# Altium schematic sheet VELOLED.SchDoc
size A2
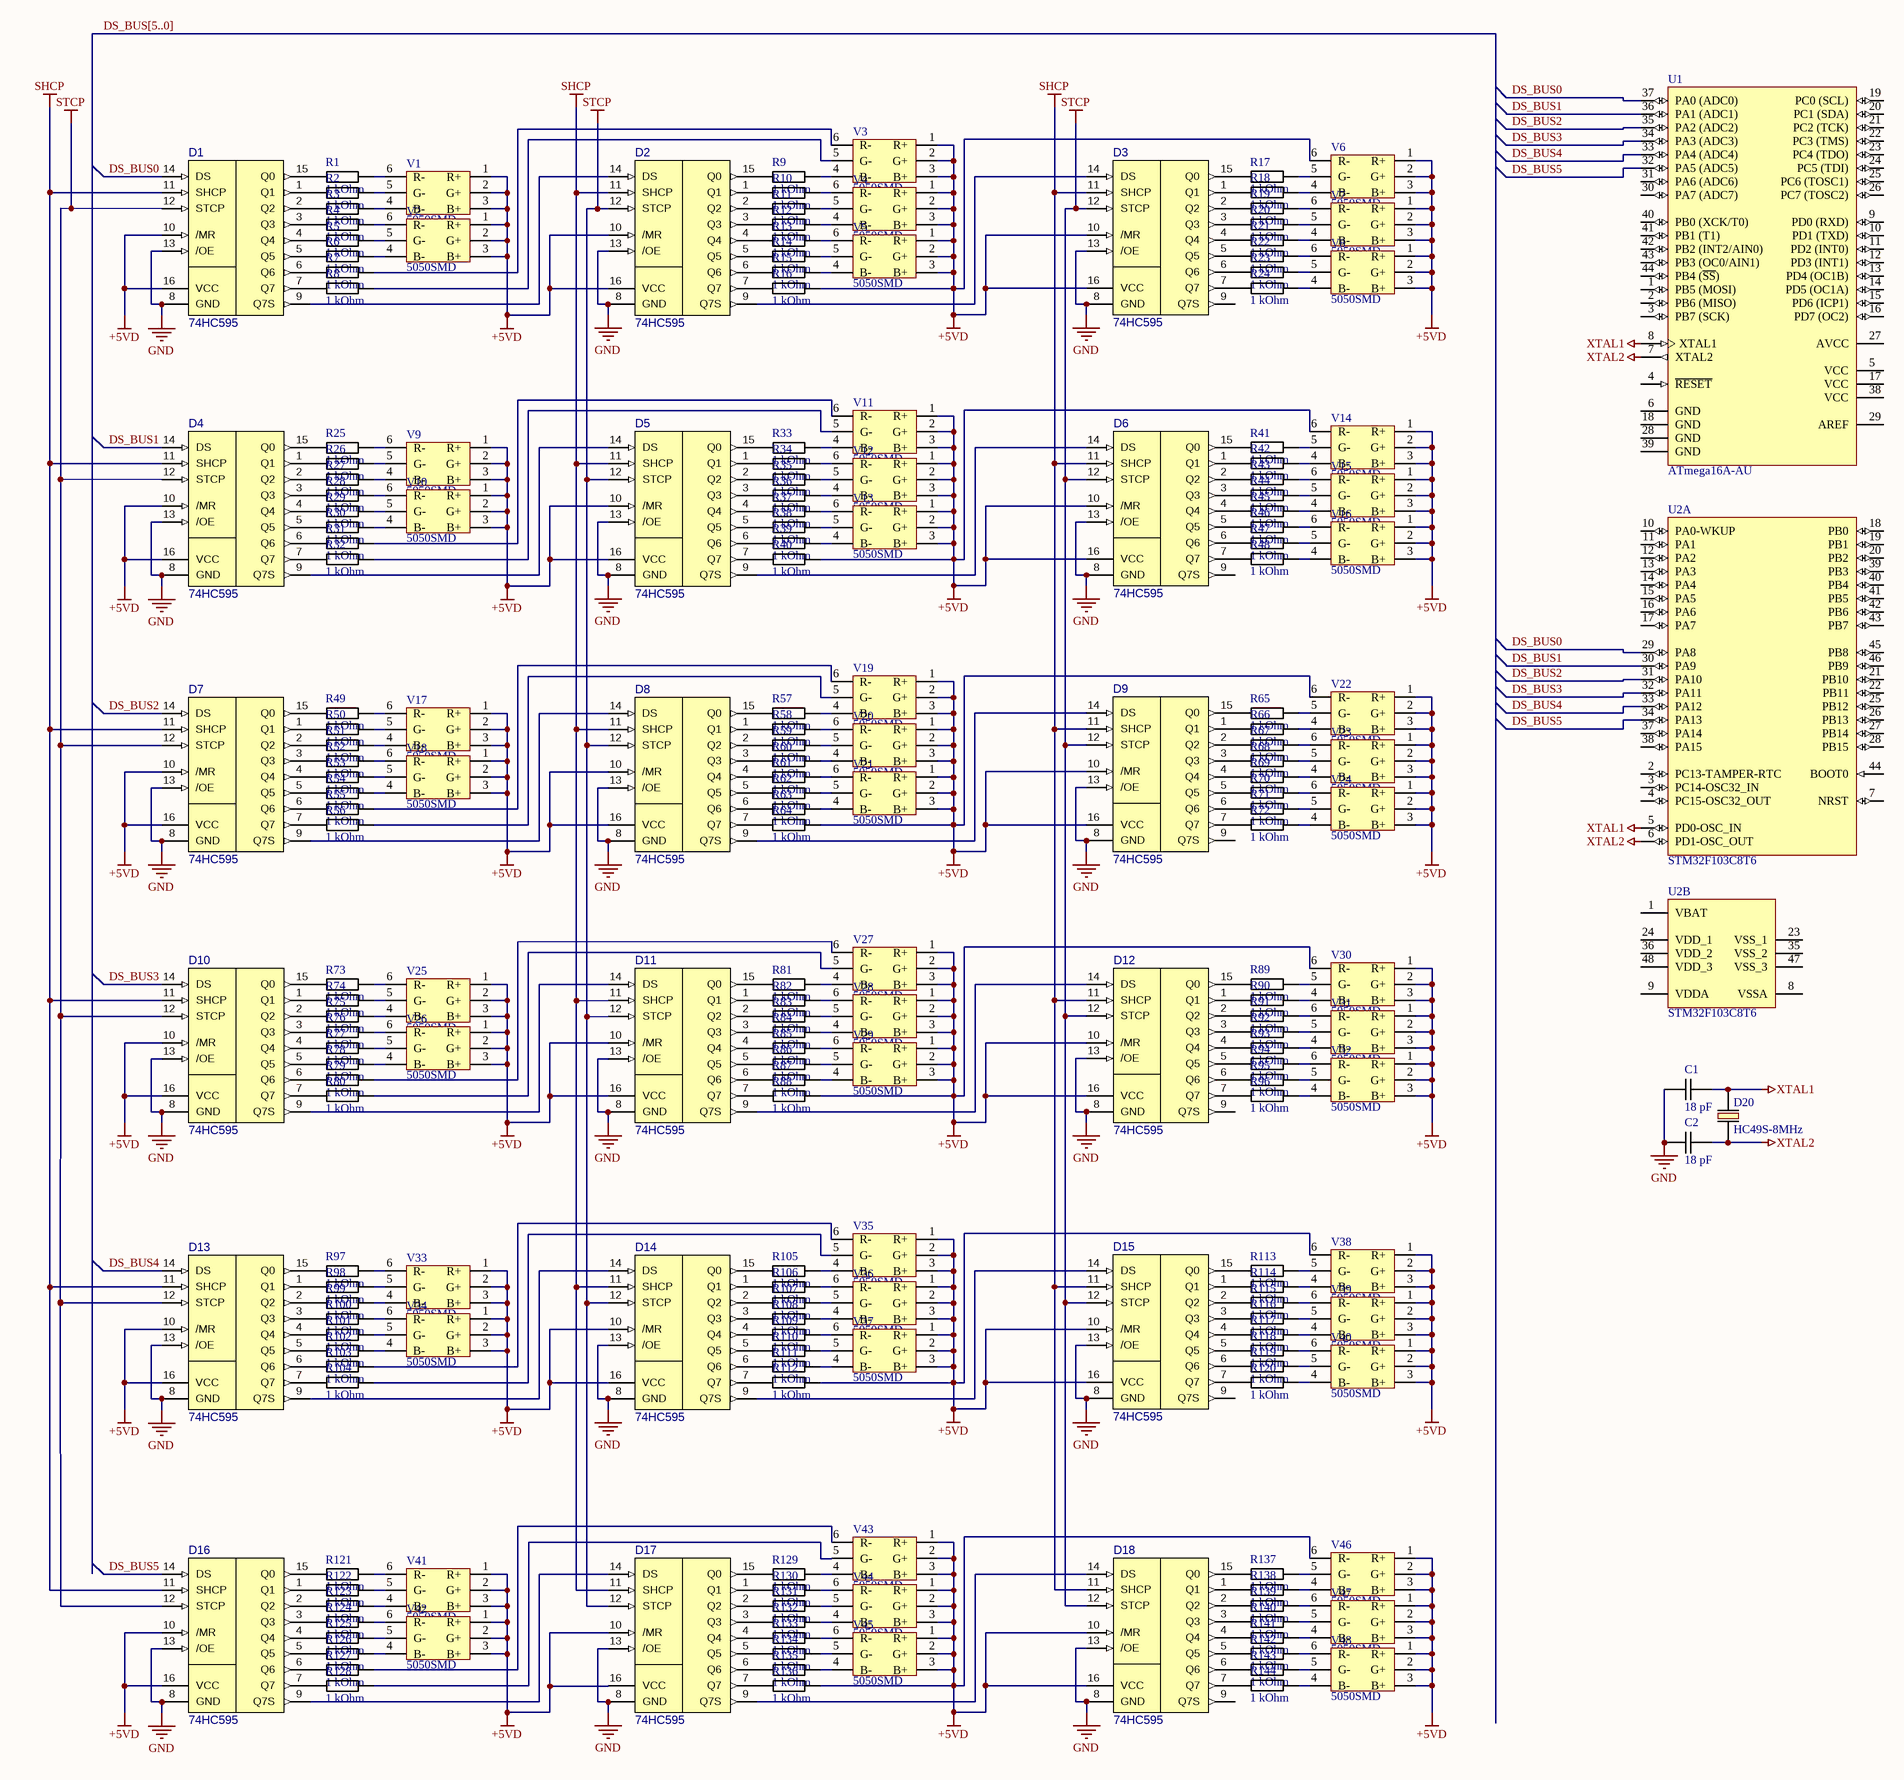
[diagram p0: VELOLED.SchDoc]

## Parts
C1  18 pF  [SMD0805]
C2  18 pF  [SMD0805]
D1  74HC595  [SO16]
D2  74HC595  [SO16]
D3  74HC595  [SO16]
D4  74HC595  [SO16]
D5  74HC595  [SO16]
D6  74HC595  [SO16]
D7  74HC595  [SO16]
D8  74HC595  [SO16]
D9  74HC595  [SO16]
D10  74HC595  [SO16]
D11  74HC595  [SO16]
D12  74HC595  [SO16]
D13  74HC595  [SO16]
D14  74HC595  [SO16]
D15  74HC595  [SO16]
D16  74HC595  [SO16]
D17  74HC595  [SO16]
D18  74HC595  [SO16]
D20  HC49S-8MHz  [HC49U]
R1  1 kOhm  [SMD0603]
R2  1 kOhm  [SMD0603]
R3  1 kOhm  [SMD0603]
R4  1 kOhm  [SMD0603]
R5  1 kOhm  [SMD0603]
R6  1 kOhm  [SMD0603]
R7  1 kOhm  [SMD0603]
R8  1 kOhm  [SMD0603]
R9  1 kOhm  [SMD0603]
R10  1 kOhm  [SMD0603]
R11  1 kOhm  [SMD0603]
R12  1 kOhm  [SMD0603]
R13  1 kOhm  [SMD0603]
R14  1 kOhm  [SMD0603]
R15  1 kOhm  [SMD0603]
R16  1 kOhm  [SMD0603]
R17  1 kOhm  [SMD0603]
R18  1 kOhm  [SMD0603]
R19  1 kOhm  [SMD0603]
R20  1 kOhm  [SMD0603]
R21  1 kOhm  [SMD0603]
R22  1 kOhm  [SMD0603]
R23  1 kOhm  [SMD0603]
R24  1 kOhm  [SMD0603]
R25  1 kOhm  [SMD0603]
R26  1 kOhm  [SMD0603]
R27  1 kOhm  [SMD0603]
R28  1 kOhm  [SMD0603]
R29  1 kOhm  [SMD0603]
R30  1 kOhm  [SMD0603]
R31  1 kOhm  [SMD0603]
R32  1 kOhm  [SMD0603]
R33  1 kOhm  [SMD0603]
R34  1 kOhm  [SMD0603]
R35  1 kOhm  [SMD0603]
R36  1 kOhm  [SMD0603]
R37  1 kOhm  [SMD0603]
R38  1 kOhm  [SMD0603]
R39  1 kOhm  [SMD0603]
R40  1 kOhm  [SMD0603]
R41  1 kOhm  [SMD0603]
R42  1 kOhm  [SMD0603]
R43  1 kOhm  [SMD0603]
R44  1 kOhm  [SMD0603]
R45  1 kOhm  [SMD0603]
R46  1 kOhm  [SMD0603]
R47  1 kOhm  [SMD0603]
R48  1 kOhm  [SMD0603]
R49  1 kOhm  [SMD0603]
R50  1 kOhm  [SMD0603]
R51  1 kOhm  [SMD0603]
R52  1 kOhm  [SMD0603]
R53  1 kOhm  [SMD0603]
R54  1 kOhm  [SMD0603]
R55  1 kOhm  [SMD0603]
R56  1 kOhm  [SMD0603]
R57  1 kOhm  [SMD0603]
R58  1 kOhm  [SMD0603]
R59  1 kOhm  [SMD0603]
R60  1 kOhm  [SMD0603]
R61  1 kOhm  [SMD0603]
R62  1 kOhm  [SMD0603]
R63  1 kOhm  [SMD0603]
R64  1 kOhm  [SMD0603]
R65  1 kOhm  [SMD0603]
R66  1 kOhm  [SMD0603]
R67  1 kOhm  [SMD0603]
R68  1 kOhm  [SMD0603]
R69  1 kOhm  [SMD0603]
R70  1 kOhm  [SMD0603]
R71  1 kOhm  [SMD0603]
R72  1 kOhm  [SMD0603]
R73  1 kOhm  [SMD0603]
R74  1 kOhm  [SMD0603]
R75  1 kOhm  [SMD0603]
R76  1 kOhm  [SMD0603]
R77  1 kOhm  [SMD0603]
R78  1 kOhm  [SMD0603]
R79  1 kOhm  [SMD0603]
R80  1 kOhm  [SMD0603]
R81  1 kOhm  [SMD0603]
R82  1 kOhm  [SMD0603]
R83  1 kOhm  [SMD0603]
R84  1 kOhm  [SMD0603]
R85  1 kOhm  [SMD0603]
R86  1 kOhm  [SMD0603]
R87  1 kOhm  [SMD0603]
R88  1 kOhm  [SMD0603]
R89  1 kOhm  [SMD0603]
R90  1 kOhm  [SMD0603]
R91  1 kOhm  [SMD0603]
R92  1 kOhm  [SMD0603]
R93  1 kOhm  [SMD0603]
R94  1 kOhm  [SMD0603]
R95  1 kOhm  [SMD0603]
R96  1 kOhm  [SMD0603]
R97  1 kOhm  [SMD0603]
R98  1 kOhm  [SMD0603]
R99  1 kOhm  [SMD0603]
R100  1 kOhm  [SMD0603]
R101  1 kOhm  [SMD0603]
R102  1 kOhm  [SMD0603]
R103  1 kOhm  [SMD0603]
R104  1 kOhm  [SMD0603]
R105  1 kOhm  [SMD0603]
R106  1 kOhm  [SMD0603]
R107  1 kOhm  [SMD0603]
R108  1 kOhm  [SMD0603]
R109  1 kOhm  [SMD0603]
R110  1 kOhm  [SMD0603]
R111  1 kOhm  [SMD0603]
R112  1 kOhm  [SMD0603]
R113  1 kOhm  [SMD0603]
R114  1 kOhm  [SMD0603]
R115  1 kOhm  [SMD0603]
R116  1 kOhm  [SMD0603]
R117  1 kOhm  [SMD0603]
R118  1 kOhm  [SMD0603]
R119  1 kOhm  [SMD0603]
R120  1 kOhm  [SMD0603]
R121  1 kOhm  [SMD0603]
R122  1 kOhm  [SMD0603]
R123  1 kOhm  [SMD0603]
R124  1 kOhm  [SMD0603]
R125  1 kOhm  [SMD0603]
R126  1 kOhm  [SMD0603]
R127  1 kOhm  [SMD0603]
R128  1 kOhm  [SMD0603]
R129  1 kOhm  [SMD0603]
R130  1 kOhm  [SMD0603]
R131  1 kOhm  [SMD0603]
R132  1 kOhm  [SMD0603]
R133  1 kOhm  [SMD0603]
R134  1 kOhm  [SMD0603]
R135  1 kOhm  [SMD0603]
R136  1 kOhm  [SMD0603]
R137  1 kOhm  [SMD0603]
R138  1 kOhm  [SMD0603]
R139  1 kOhm  [SMD0603]
R140  1 kOhm  [SMD0603]
R141  1 kOhm  [SMD0603]
R142  1 kOhm  [SMD0603]
R143  1 kOhm  [SMD0603]
R144  1 kOhm  [SMD0603]
U1  ATmega16A-AU  [44A_N]
U2  STM32F103C8T6  [STM-LQFP48_N]  (parts A,B of 2)
V1  5050SMD  [SMD5050 6PIN RGB]
V2  5050SMD  [SMD5050 6PIN RGB]
V3  5050SMD  [SMD5050 6PIN RGB]
V4  5050SMD  [SMD5050 6PIN RGB]
V5  5050SMD  [SMD5050 6PIN RGB]
V6  5050SMD  [SMD5050 6PIN RGB]
V7  5050SMD  [SMD5050 6PIN RGB]
V8  5050SMD  [SMD5050 6PIN RGB]
V9  5050SMD  [SMD5050 6PIN RGB]
V10  5050SMD  [SMD5050 6PIN RGB]
V11  5050SMD  [SMD5050 6PIN RGB]
V12  5050SMD  [SMD5050 6PIN RGB]
V13  5050SMD  [SMD5050 6PIN RGB]
V14  5050SMD  [SMD5050 6PIN RGB]
V15  5050SMD  [SMD5050 6PIN RGB]
V16  5050SMD  [SMD5050 6PIN RGB]
V17  5050SMD  [SMD5050 6PIN RGB]
V18  5050SMD  [SMD5050 6PIN RGB]
V19  5050SMD  [SMD5050 6PIN RGB]
V20  5050SMD  [SMD5050 6PIN RGB]
V21  5050SMD  [SMD5050 6PIN RGB]
V22  5050SMD  [SMD5050 6PIN RGB]
V23  5050SMD  [SMD5050 6PIN RGB]
V24  5050SMD  [SMD5050 6PIN RGB]
V25  5050SMD  [SMD5050 6PIN RGB]
V26  5050SMD  [SMD5050 6PIN RGB]
V27  5050SMD  [SMD5050 6PIN RGB]
V28  5050SMD  [SMD5050 6PIN RGB]
V29  5050SMD  [SMD5050 6PIN RGB]
V30  5050SMD  [SMD5050 6PIN RGB]
V31  5050SMD  [SMD5050 6PIN RGB]
V32  5050SMD  [SMD5050 6PIN RGB]
V33  5050SMD  [SMD5050 6PIN RGB]
V34  5050SMD  [SMD5050 6PIN RGB]
V35  5050SMD  [SMD5050 6PIN RGB]
V36  5050SMD  [SMD5050 6PIN RGB]
V37  5050SMD  [SMD5050 6PIN RGB]
V38  5050SMD  [SMD5050 6PIN RGB]
V39  5050SMD  [SMD5050 6PIN RGB]
V40  5050SMD  [SMD5050 6PIN RGB]
V41  5050SMD  [SMD5050 6PIN RGB]
V42  5050SMD  [SMD5050 6PIN RGB]
V43  5050SMD  [SMD5050 6PIN RGB]
V44  5050SMD  [SMD5050 6PIN RGB]
V45  5050SMD  [SMD5050 6PIN RGB]
V46  5050SMD  [SMD5050 6PIN RGB]
V47  5050SMD  [SMD5050 6PIN RGB]
V48  5050SMD  [SMD5050 6PIN RGB]

## Nets
+5VD: D1.10(/MR) D1.16(VCC) D2.10(/MR) D2.16(VCC) D3.10(/MR) D3.16(VCC) D4.10(/MR) D4.16(VCC) D5.10(/MR) D5.16(VCC) D6.10(/MR) D6.16(VCC) D7.10(/MR) D7.16(VCC) D8.10(/MR) D8.16(VCC) D9.10(/MR) D9.16(VCC) D10.10(/MR) D10.16(VCC) D11.10(/MR) D11.16(VCC) D12.10(/MR) D12.16(VCC) D13.10(/MR) D13.16(VCC) D14.10(/MR) D14.16(VCC) D15.10(/MR) D15.16(VCC) D16.10(/MR) D16.16(VCC) D17.10(/MR) D17.16(VCC) D18.10(/MR) D18.16(VCC) R16.2 R40.2 R64.2 R88.2 R112.2 R136.2 V1.1(R+) V1.2(G+) V1.3(B+) V2.1(R+) V2.2(G+) V2.3(B+) V3.1(R+) V3.2(G+) V3.3(B+) V4.1(R+) V4.2(G+) V4.3(B+) V5.1(R+) V5.2(G+) V5.3(B+) V6.1(R+) V6.2(G+) V6.3(B+) V6.6(R-) V7.1(R+) V7.2(G+) V7.3(B+) V8.1(R+) V8.2(G+) V8.3(B+) V9.1(R+) V9.2(G+) V9.3(B+) V10.1(R+) V10.2(G+) V10.3(B+) V11.1(R+) V11.2(G+) V11.3(B+) V12.1(R+) V12.2(G+) V12.3(B+) V13.1(R+) V13.2(G+) V13.3(B+) V14.1(R+) V14.2(G+) V14.3(B+) V14.6(R-) V15.1(R+) V15.2(G+) V15.3(B+) V16.1(R+) V16.2(G+) V16.3(B+) V17.1(R+) V17.2(G+) V17.3(B+) V18.1(R+) V18.2(G+) V18.3(B+) V19.1(R+) V19.2(G+) V19.3(B+) V20.1(R+) V20.2(G+) V20.3(B+) V21.1(R+) V21.2(G+) V21.3(B+) V22.1(R+) V22.2(G+) V22.3(B+) V22.6(R-) V23.1(R+) V23.2(G+) V23.3(B+) V24.1(R+) V24.2(G+) V24.3(B+) V25.1(R+) V25.2(G+) V25.3(B+) V26.1(R+) V26.2(G+) V26.3(B+) V27.1(R+) V27.2(G+) V27.3(B+) V28.1(R+) V28.2(G+) V28.3(B+) V29.1(R+) V29.2(G+) V29.3(B+) V30.1(R+) V30.2(G+) V30.3(B+) V30.6(R-) V31.1(R+) V31.2(G+) V31.3(B+) V32.1(R+) V32.2(G+) V32.3(B+) V33.1(R+) V33.2(G+) V33.3(B+) V34.1(R+) V34.2(G+) V34.3(B+) V35.1(R+) V35.2(G+) V35.3(B+) V36.1(R+) V36.2(G+) V36.3(B+) V37.1(R+) V37.2(G+) V37.3(B+) V38.1(R+) V38.2(G+) V38.3(B+) V38.6(R-) V39.1(R+) V39.2(G+) V39.3(B+) V40.1(R+) V40.2(G+) V40.3(B+) V41.1(R+) V41.2(G+) V41.3(B+) V42.1(R+) V42.2(G+) V42.3(B+) V43.1(R+) V43.2(G+) V43.3(B+) V44.1(R+) V44.2(G+) V44.3(B+) V45.1(R+) V45.2(G+) V45.3(B+) V46.1(R+) V46.2(G+) V46.3(B+) V46.6(R-) V47.1(R+) V47.2(G+) V47.3(B+) V48.1(R+) V48.2(G+) V48.3(B+)
GND: C1.1 C2.1 D1.8(GND) D1.13(/OE) D2.8(GND) D2.13(/OE) D3.8(GND) D3.13(/OE) D4.8(GND) D4.13(/OE) D5.8(GND) D5.13(/OE) D6.8(GND) D6.13(/OE) D7.8(GND) D7.13(/OE) D8.8(GND) D8.13(/OE) D9.8(GND) D9.13(/OE) D10.8(GND) D10.13(/OE) D11.8(GND) D11.13(/OE) D12.8(GND) D12.13(/OE) D13.8(GND) D13.13(/OE) D14.8(GND) D14.13(/OE) D15.8(GND) D15.13(/OE) D16.8(GND) D16.13(/OE) D17.8(GND) D17.13(/OE) D18.8(GND) D18.13(/OE)
SHCP: D1.11(SHCP) D2.11(SHCP) D3.11(SHCP) D4.11(SHCP) D5.11(SHCP) D6.11(SHCP) D7.11(SHCP) D8.11(SHCP) D9.11(SHCP) D10.11(SHCP) D11.11(SHCP) D12.11(SHCP) D13.11(SHCP) D14.11(SHCP) D15.11(SHCP) D16.11(SHCP) D17.11(SHCP) D18.11(SHCP)
STCP: D1.12(STCP) D2.12(STCP) D3.12(STCP) D4.12(STCP) D5.12(STCP) D6.12(STCP) D7.12(STCP) D8.12(STCP) D9.12(STCP) D10.12(STCP) D11.12(STCP) D12.12(STCP) D13.12(STCP) D14.12(STCP) D15.12(STCP) D16.12(STCP) D17.12(STCP) D18.12(STCP)
XTAL1: C1.2 D20.1 U1.8(XTAL1) U2.5(PD0-OSC_IN)
XTAL2: C2.2 D20.2 U1.7(XTAL2) U2.6(PD1-OSC_OUT)
DS_BUS0: D1.14(DS) U1.37(PA0_(ADC0)) U2.29(PA8)
DS_BUS1: D4.14(DS) U1.36(PA1_(ADC1)) U2.30(PA9)
DS_BUS2: D7.14(DS) U1.35(PA2_(ADC2)) U2.31(PA10)
DS_BUS3: D10.14(DS) U1.34(PA3_(ADC3)) U2.32(PA11)
DS_BUS4: D13.14(DS) U1.33(PA4_(ADC4)) U2.33(PA12)
DS_BUS5: D16.14(DS) U1.32(PA5_(ADC5)) U2.34(PA13)
NetD1_1: D1.1(Q1) R2.1
NetD1_2: D1.2(Q2) R3.1
NetD1_3: D1.3(Q3) R4.1
NetD1_4: D1.4(Q4) R5.1
NetD1_5: D1.5(Q5) R6.1
NetD1_6: D1.6(Q6) R7.1
NetD1_7: D1.7(Q7) R8.1
NetD1_9: D1.9(Q7S) D2.14(DS)
NetD1_15: D1.15(Q0) R1.1
NetD2_1: D2.1(Q1) R10.1
NetD2_2: D2.2(Q2) R11.1
NetD2_3: D2.3(Q3) R12.1
NetD2_4: D2.4(Q4) R13.1
NetD2_5: D2.5(Q5) R14.1
NetD2_6: D2.6(Q6) R15.1
NetD2_7: D2.7(Q7) R16.1
NetD2_9: D2.9(Q7S) D3.14(DS)
NetD2_15: D2.15(Q0) R9.1
NetD3_1: D3.1(Q1) R18.1
NetD3_2: D3.2(Q2) R19.1
NetD3_3: D3.3(Q3) R20.1
NetD3_4: D3.4(Q4) R21.1
NetD3_5: D3.5(Q5) R22.1
NetD3_6: D3.6(Q6) R23.1
NetD3_7: D3.7(Q7) R24.1
NetD3_15: D3.15(Q0) R17.1
NetD4_1: D4.1(Q1) R26.1
NetD4_2: D4.2(Q2) R27.1
NetD4_3: D4.3(Q3) R28.1
NetD4_4: D4.4(Q4) R29.1
NetD4_5: D4.5(Q5) R30.1
NetD4_6: D4.6(Q6) R31.1
NetD4_7: D4.7(Q7) R32.1
NetD4_9: D4.9(Q7S) D5.14(DS)
NetD4_15: D4.15(Q0) R25.1
NetD5_1: D5.1(Q1) R34.1
NetD5_2: D5.2(Q2) R35.1
NetD5_3: D5.3(Q3) R36.1
NetD5_4: D5.4(Q4) R37.1
NetD5_5: D5.5(Q5) R38.1
NetD5_6: D5.6(Q6) R39.1
NetD5_7: D5.7(Q7) R40.1
NetD5_9: D5.9(Q7S) D6.14(DS)
NetD5_15: D5.15(Q0) R33.1
NetD6_1: D6.1(Q1) R42.1
NetD6_2: D6.2(Q2) R43.1
NetD6_3: D6.3(Q3) R44.1
NetD6_4: D6.4(Q4) R45.1
NetD6_5: D6.5(Q5) R46.1
NetD6_6: D6.6(Q6) R47.1
NetD6_7: D6.7(Q7) R48.1
NetD6_15: D6.15(Q0) R41.1
NetD7_1: D7.1(Q1) R50.1
NetD7_2: D7.2(Q2) R51.1
NetD7_3: D7.3(Q3) R52.1
NetD7_4: D7.4(Q4) R53.1
NetD7_5: D7.5(Q5) R54.1
NetD7_6: D7.6(Q6) R55.1
NetD7_7: D7.7(Q7) R56.1
NetD7_9: D7.9(Q7S) D8.14(DS)
NetD7_15: D7.15(Q0) R49.1
NetD8_1: D8.1(Q1) R58.1
NetD8_2: D8.2(Q2) R59.1
NetD8_3: D8.3(Q3) R60.1
NetD8_4: D8.4(Q4) R61.1
NetD8_5: D8.5(Q5) R62.1
NetD8_6: D8.6(Q6) R63.1
NetD8_7: D8.7(Q7) R64.1
NetD8_9: D8.9(Q7S) D9.14(DS)
NetD8_15: D8.15(Q0) R57.1
NetD9_1: D9.1(Q1) R66.1
NetD9_2: D9.2(Q2) R67.1
NetD9_3: D9.3(Q3) R68.1
NetD9_4: D9.4(Q4) R69.1
NetD9_5: D9.5(Q5) R70.1
NetD9_6: D9.6(Q6) R71.1
NetD9_7: D9.7(Q7) R72.1
NetD9_15: D9.15(Q0) R65.1
NetD10_1: D10.1(Q1) R74.1
NetD10_2: D10.2(Q2) R75.1
NetD10_3: D10.3(Q3) R76.1
NetD10_4: D10.4(Q4) R77.1
NetD10_5: D10.5(Q5) R78.1
NetD10_6: D10.6(Q6) R79.1
NetD10_7: D10.7(Q7) R80.1
NetD10_9: D10.9(Q7S) D11.14(DS)
NetD10_15: D10.15(Q0) R73.1
NetD11_1: D11.1(Q1) R82.1
NetD11_2: D11.2(Q2) R83.1
NetD11_3: D11.3(Q3) R84.1
NetD11_4: D11.4(Q4) R85.1
NetD11_5: D11.5(Q5) R86.1
NetD11_6: D11.6(Q6) R87.1
NetD11_7: D11.7(Q7) R88.1
NetD11_9: D11.9(Q7S) D12.14(DS)
NetD11_15: D11.15(Q0) R81.1
NetD12_1: D12.1(Q1) R90.1
NetD12_2: D12.2(Q2) R91.1
NetD12_3: D12.3(Q3) R92.1
NetD12_4: D12.4(Q4) R93.1
NetD12_5: D12.5(Q5) R94.1
NetD12_6: D12.6(Q6) R95.1
NetD12_7: D12.7(Q7) R96.1
NetD12_15: D12.15(Q0) R89.1
NetD13_1: D13.1(Q1) R98.1
NetD13_2: D13.2(Q2) R99.1
NetD13_3: D13.3(Q3) R100.1
NetD13_4: D13.4(Q4) R101.1
NetD13_5: D13.5(Q5) R102.1
NetD13_6: D13.6(Q6) R103.1
NetD13_7: D13.7(Q7) R104.1
NetD13_9: D13.9(Q7S) D14.14(DS)
NetD13_15: D13.15(Q0) R97.1
NetD14_1: D14.1(Q1) R106.1
NetD14_2: D14.2(Q2) R107.1
NetD14_3: D14.3(Q3) R108.1
NetD14_4: D14.4(Q4) R109.1
NetD14_5: D14.5(Q5) R110.1
NetD14_6: D14.6(Q6) R111.1
NetD14_7: D14.7(Q7) R112.1
NetD14_9: D14.9(Q7S) D15.14(DS)
NetD14_15: D14.15(Q0) R105.1
NetD15_1: D15.1(Q1) R114.1
NetD15_2: D15.2(Q2) R115.1
NetD15_3: D15.3(Q3) R116.1
NetD15_4: D15.4(Q4) R117.1
NetD15_5: D15.5(Q5) R118.1
NetD15_6: D15.6(Q6) R119.1
NetD15_7: D15.7(Q7) R120.1
NetD15_15: D15.15(Q0) R113.1
NetD16_1: D16.1(Q1) R122.1
NetD16_2: D16.2(Q2) R123.1
NetD16_3: D16.3(Q3) R124.1
NetD16_4: D16.4(Q4) R125.1
NetD16_5: D16.5(Q5) R126.1
NetD16_6: D16.6(Q6) R127.1
NetD16_7: D16.7(Q7) R128.1
NetD16_9: D16.9(Q7S) D17.14(DS)
NetD16_15: D16.15(Q0) R121.1
NetD17_1: D17.1(Q1) R130.1
NetD17_2: D17.2(Q2) R131.1
NetD17_3: D17.3(Q3) R132.1
NetD17_4: D17.4(Q4) R133.1
NetD17_5: D17.5(Q5) R134.1
NetD17_6: D17.6(Q6) R135.1
NetD17_7: D17.7(Q7) R136.1
NetD17_9: D17.9(Q7S) D18.14(DS)
NetD17_15: D17.15(Q0) R129.1
NetD18_1: D18.1(Q1) R138.1
NetD18_2: D18.2(Q2) R139.1
NetD18_3: D18.3(Q3) R140.1
NetD18_4: D18.4(Q4) R141.1
NetD18_5: D18.5(Q5) R142.1
NetD18_6: D18.6(Q6) R143.1
NetD18_7: D18.7(Q7) R144.1
NetD18_15: D18.15(Q0) R137.1
NetR1_2: R1.2 V1.6(R-)
NetR2_2: R2.2 V1.5(G-)
NetR3_2: R3.2 V1.4(B-)
NetR4_2: R4.2 V2.6(R-)
NetR5_2: R5.2 V2.5(G-)
NetR6_2: R6.2 V2.4(B-)
NetR7_2: R7.2 V3.6(R-)
NetR8_2: R8.2 V3.5(G-)
NetR9_2: R9.2 V3.4(B-)
NetR10_2: R10.2 V4.6(R-)
NetR11_2: R11.2 V4.5(G-)
NetR12_2: R12.2 V4.4(B-)
NetR13_2: R13.2 V5.6(R-)
NetR14_2: R14.2 V5.5(G-)
NetR15_2: R15.2 V5.4(B-)
NetR17_2: R17.2 V6.5(G-)
NetR18_2: R18.2 V6.4(B-)
NetR19_2: R19.2 V7.6(R-)
NetR20_2: R20.2 V7.5(G-)
NetR21_2: R21.2 V7.4(B-)
NetR22_2: R22.2 V8.6(R-)
NetR23_2: R23.2 V8.5(G-)
NetR24_2: R24.2 V8.4(B-)
NetR25_2: R25.2 V9.6(R-)
NetR26_2: R26.2 V9.5(G-)
NetR27_2: R27.2 V9.4(B-)
NetR28_2: R28.2 V10.6(R-)
NetR29_2: R29.2 V10.5(G-)
NetR30_2: R30.2 V10.4(B-)
NetR31_2: R31.2 V11.6(R-)
NetR32_2: R32.2 V11.5(G-)
NetR33_2: R33.2 V11.4(B-)
NetR34_2: R34.2 V12.6(R-)
NetR35_2: R35.2 V12.5(G-)
NetR36_2: R36.2 V12.4(B-)
NetR37_2: R37.2 V13.6(R-)
NetR38_2: R38.2 V13.5(G-)
NetR39_2: R39.2 V13.4(B-)
NetR41_2: R41.2 V14.5(G-)
NetR42_2: R42.2 V14.4(B-)
NetR43_2: R43.2 V15.6(R-)
NetR44_2: R44.2 V15.5(G-)
NetR45_2: R45.2 V15.4(B-)
NetR46_2: R46.2 V16.6(R-)
NetR47_2: R47.2 V16.5(G-)
NetR48_2: R48.2 V16.4(B-)
NetR49_2: R49.2 V17.6(R-)
NetR50_2: R50.2 V17.5(G-)
NetR51_2: R51.2 V17.4(B-)
NetR52_2: R52.2 V18.6(R-)
NetR53_2: R53.2 V18.5(G-)
NetR54_2: R54.2 V18.4(B-)
NetR55_2: R55.2 V19.6(R-)
NetR56_2: R56.2 V19.5(G-)
NetR57_2: R57.2 V19.4(B-)
NetR58_2: R58.2 V20.6(R-)
NetR59_2: R59.2 V20.5(G-)
NetR60_2: R60.2 V20.4(B-)
NetR61_2: R61.2 V21.6(R-)
NetR62_2: R62.2 V21.5(G-)
NetR63_2: R63.2 V21.4(B-)
NetR65_2: R65.2 V22.5(G-)
NetR66_2: R66.2 V22.4(B-)
NetR67_2: R67.2 V23.6(R-)
NetR68_2: R68.2 V23.5(G-)
NetR69_2: R69.2 V23.4(B-)
NetR70_2: R70.2 V24.6(R-)
NetR71_2: R71.2 V24.5(G-)
NetR72_2: R72.2 V24.4(B-)
NetR73_2: R73.2 V25.6(R-)
NetR74_2: R74.2 V25.5(G-)
NetR75_2: R75.2 V25.4(B-)
NetR76_2: R76.2 V26.6(R-)
NetR77_2: R77.2 V26.5(G-)
NetR78_2: R78.2 V26.4(B-)
NetR79_2: R79.2 V27.6(R-)
NetR80_2: R80.2 V27.5(G-)
NetR81_2: R81.2 V27.4(B-)
NetR82_2: R82.2 V28.6(R-)
NetR83_2: R83.2 V28.5(G-)
NetR84_2: R84.2 V28.4(B-)
NetR85_2: R85.2 V29.6(R-)
NetR86_2: R86.2 V29.5(G-)
NetR87_2: R87.2 V29.4(B-)
NetR89_2: R89.2 V30.5(G-)
NetR90_2: R90.2 V30.4(B-)
NetR91_2: R91.2 V31.6(R-)
NetR92_2: R92.2 V31.5(G-)
NetR93_2: R93.2 V31.4(B-)
NetR94_2: R94.2 V32.6(R-)
NetR95_2: R95.2 V32.5(G-)
NetR96_2: R96.2 V32.4(B-)
NetR97_2: R97.2 V33.6(R-)
NetR98_2: R98.2 V33.5(G-)
NetR99_2: R99.2 V33.4(B-)
NetR100_2: R100.2 V34.6(R-)
NetR101_2: R101.2 V34.5(G-)
NetR102_2: R102.2 V34.4(B-)
NetR103_2: R103.2 V35.6(R-)
NetR104_2: R104.2 V35.5(G-)
NetR105_2: R105.2 V35.4(B-)
NetR106_2: R106.2 V36.6(R-)
NetR107_2: R107.2 V36.5(G-)
NetR108_2: R108.2 V36.4(B-)
NetR109_2: R109.2 V37.6(R-)
NetR110_2: R110.2 V37.5(G-)
NetR111_2: R111.2 V37.4(B-)
NetR113_2: R113.2 V38.5(G-)
NetR114_2: R114.2 V38.4(B-)
NetR115_2: R115.2 V39.6(R-)
NetR116_2: R116.2 V39.5(G-)
NetR117_2: R117.2 V39.4(B-)
NetR118_2: R118.2 V40.6(R-)
NetR119_2: R119.2 V40.5(G-)
NetR120_2: R120.2 V40.4(B-)
NetR121_2: R121.2 V41.6(R-)
NetR122_2: R122.2 V41.5(G-)
NetR123_2: R123.2 V41.4(B-)
NetR124_2: R124.2 V42.6(R-)
NetR125_2: R125.2 V42.5(G-)
NetR126_2: R126.2 V42.4(B-)
NetR127_2: R127.2 V43.6(R-)
NetR128_2: R128.2 V43.5(G-)
NetR129_2: R129.2 V43.4(B-)
NetR130_2: R130.2 V44.6(R-)
NetR131_2: R131.2 V44.5(G-)
NetR132_2: R132.2 V44.4(B-)
NetR133_2: R133.2 V45.6(R-)
NetR134_2: R134.2 V45.5(G-)
NetR135_2: R135.2 V45.4(B-)
NetR137_2: R137.2 V46.5(G-)
NetR138_2: R138.2 V46.4(B-)
NetR139_2: R139.2 V47.6(R-)
NetR140_2: R140.2 V47.5(G-)
NetR141_2: R141.2 V47.4(B-)
NetR142_2: R142.2 V48.6(R-)
NetR143_2: R143.2 V48.5(G-)
NetR144_2: R144.2 V48.4(B-)

Not connected (* = marked no-connect by the designer): D3 9(Q7S); D6 9(Q7S); D9 9(Q7S); D12 9(Q7S); D15 9(Q7S); D18 9(Q7S); U1 1(PB5_(MOSI)) 2(PB6_(MISO)) 3(PB7_(SCK)) 4(~{RESET}) 5(VCC) 6(GND) 9(PD0_(RXD)) 10(PD1_(TXD)) 11(PD2_(INT0)) 12(PD3_(INT1)) 13(PD4_(OC1B)) 14(PD5_(OC1A)) 15(PD6_(ICP1)) 16(PD7_(OC2)) 17(VCC) 18(GND) 19(PC0_(SCL)) 20(PC1_(SDA)) 21(PC2_(TCK)) 22(PC3_(TMS)) 23(PC4_(TDO)) 24(PC5_(TDI)) 25(PC6_(TOSC1)) 26(PC7_(TOSC2)) 27(AVCC) 28(GND) 29(AREF) 30(PA7_(ADC7)) 31(PA6_(ADC6)) 38(VCC) 39(GND) 40(PB0_(XCK/T0)) 41(PB1_(T1)) 42(PB2_(INT2/AIN0)) 43(PB3_(OC0/AIN1)) 44(PB4_(~{SS})); U2 1(VBAT) 2(PC13-TAMPER-RTC) 3(PC14-OSC32_IN) 4(PC15-OSC32_OUT) 7(NRST) 8(VSSA) 9(VDDA) 10(PA0-WKUP) 11(PA1) 12(PA2) 13(PA3) 14(PA4) 15(PA5) 16(PA6) 17(PA7) 18(PB0) 19(PB1) 20(PB2) 21(PB10) 22(PB11) 23(VSS_1) 24(VDD_1) 25(PB12) 26(PB13) 27(PB14) 28(PB15) 35(VSS_2) 36(VDD_2) 37(PA14) 38(PA15) 39(PB3) 40(PB4) 41(PB5) 42(PB6) 43(PB7) 44(BOOT0) 45(PB8) 46(PB9) 47(VSS_3) 48(VDD_3)

## Buses and harness runs
bus DS_BUS[5..0]

## Library data of the parts
C1 C2 = Capacitor SMD0805: Ceramic
D20 = HC49S-8MHz: Crystal oscillator 16MHz
R1-R144 = SMD0603: Resistor 0.125W
U1 = ATmega16A-AU: 8-bit AVR Microcontroller, 16KB Flash, 512 Bytes EEPROM, 1KB SRAM, 44-pin TQFP, Industrial Grade (-40°C to 85°C); Published: 1-Apr-2010; DatasheetVersion: revB, Jul-2009; PackageVersion: rev.B, Oct-2001; PackageReference: 44A; Publisher: Altium Limited; PackageDescription: 44-Pin Plastic Thin Profile Quad Flat Pack, 10 x 10 x 1.0 mm Body, 0.8 mm Pitch (TQFP); Supplier 1: Digi-Key; Supplier Part Number 1: ATMEGA16A-AU-ND; Supplier 2: Farnell; Supplier Part Number 2: 1704560; Supplier 3: Mouser; Supplier Part Number 3: 556-ATMEGA16A-AU; ComponentLink1Description: Manufacturer Link; ComponentLink1URL: http://www.atmel.com/products/avr/default.asp?; ComponentLink2Description: ATmega16A Datasheet; ComponentLink2URL: http://www.atmel.com/dyn/resources/prod_documents/doc8154.pdf; ComponentLink3Description: ATmega16A Summary; ComponentLink3URL: http://www.atmel.com/dyn/resources/prod_documents/8154S.pdf; ComponentLink4Description: Atmel.com Home; ComponentLink4URL: http://www.atmel.com
U2 = STM32F103C8T6: ARM Cortex-M3 32-bit MCU, 64 KB Flash, 20 KB Internal RAM, 37 I/Os, 48-pin LQFP, -40 to 85 degC, Tray; A/D Converter: 2x12-bit (10 Channel); FLASH Size (Prog) (kB): 64; I/Os (High Current): 37; Internal RAM Size (kB): 20; Operating Frequency(F) (Processor speed) (MHz): 72; Supply Voltage(Vcc) min (V): 2; DatasheetVersion: Rev. 16; PackageVersion: Rev. 6, 06/2013; PackageReference: LQFP48; PackageDescription: 48-Pin Low Profile Quad Flat Package, 7 x 7 mm Body, 0.5 mm Pitch; Supplier 1: Digi-Key; Supplier Part Number 1: 497-6063-ND; Supplier 2: Farnell; Supplier Part Number 2: 1447637; Supplier 3: Newark; Supplier Part Number 3: 59M2182; Supplier 4: Newark; Supplier Part Number 4: 57P1222; Supplier 5: Mouser; Supplier Part Number 5: 511-STM32F103C8T6; Core: ARM Cortex-M3; Packing: Tray; Mounting Technology: Surface Mount; PartNumber: STM32F103C8T6; ComponentLink1Description: Manufacturer URL; ComponentLink1URL: http://www.st.com/web/en/home.html; ComponentLink2Description: Datasheet; ComponentLink2URL: http://www.st.com/st-web-ui/static/active/en/resource/technical/document/datasheet/CD00161566.pdf; ComponentLink3Description: Package Specification; ComponentLink3URL: http://www.st.com/st-web-ui/static/active/en/resource/technical/document/datasheet/DM00058181.pdf
V1-V48 = 5050SMD RGB LED mini: LED RGB
D1-D18 = 74HC595: Value: *